# EAGLE design formBit (EAGLE 9.5.2)
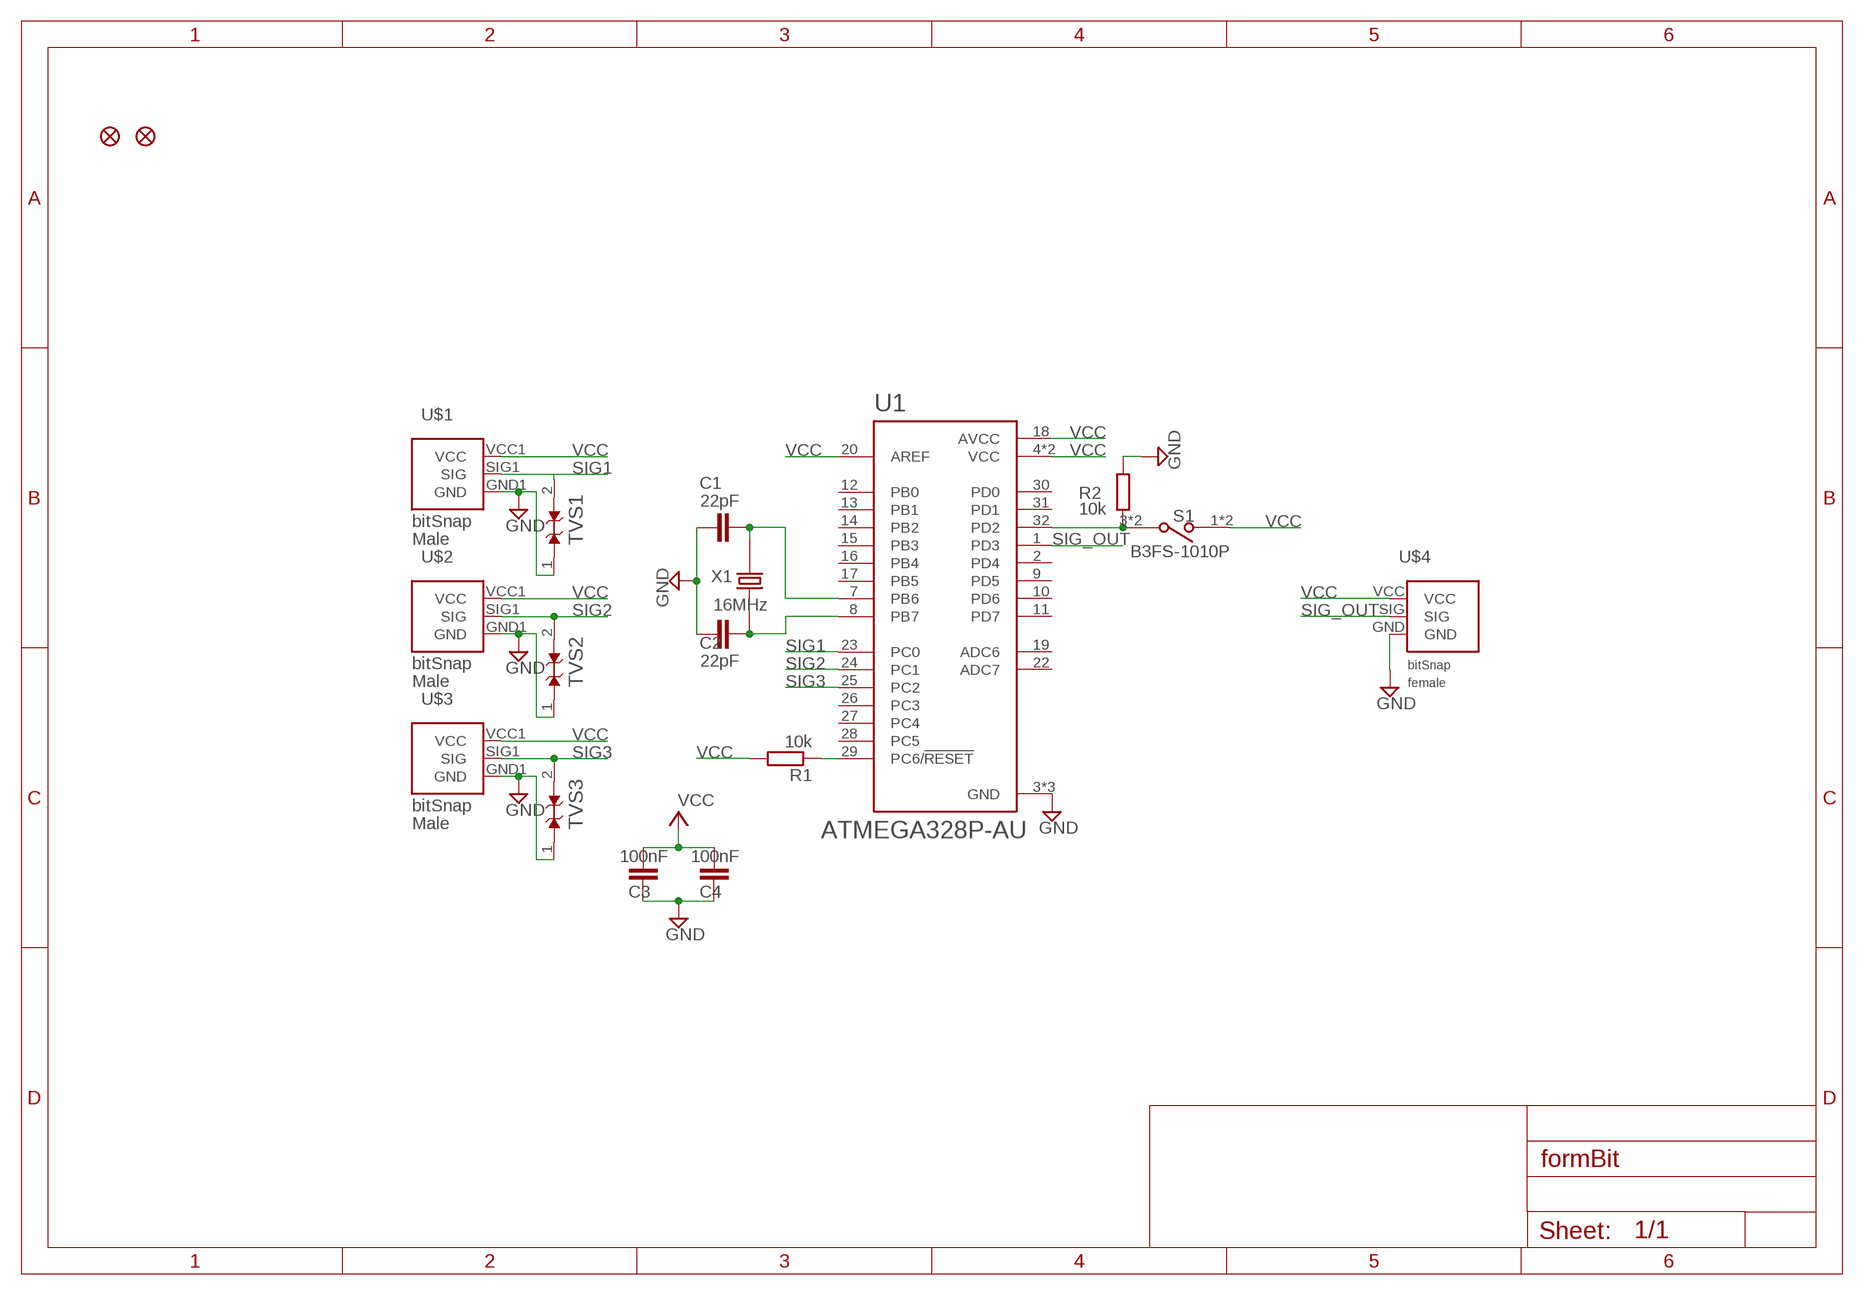
[diagram p0: schematic, sheet 1]

## Parts
C1  22pF  C-EUC0805  [C0805]
C2  22pF  C-EUC0805  [C0805]
C3  100nF  C-EUC0805  [C0805]
C4  100nF  C-EUC0805  [C0805]
R1  10k  R-EU_R0805  [R0805]
R2  10k  R-EU_R0805  [R0805]
S1  B3FS-1010P  [SW_B3FS-1010P]
TVS1  ESD9B5.0ST5G  [SODFL1006X40N]
TVS2  ESD9B5.0ST5G  [SODFL1006X40N]
TVS3  ESD9B5.0ST5G  [SODFL1006X40N]
U1  ATMEGA328P-AU  [QFP80P900X900X120-32N]
U$1  BITSNAP_V03_MALE  [BITSNAP_V03_MALE]
U$2  BITSNAP_V03_MALE  [BITSNAP_V03_MALE]
U$3  BITSNAP_V03_MALE  [BITSNAP_V03_MALE]
U$4  BITSNAP_V03_FEMALE  [BITSNAP_V03_FEMALE]
U$5  FIDUCIAL  [FIDUCIAL1X2.5]
U$6  FIDUCIAL  [FIDUCIAL1X2.5]
X1  16MHz  7A-24.000MAAJ-T  [XTAL500X320X120]

## Nets
GND: C1.1 C2.1 C3.1 C4.1 R2.1 TVS1.1(A) TVS2.1(A) TVS3.1(A) U1.3(GND) U1.5(GND) U1.21(GND) U$1.GND1(GND) U$2.GND1(GND) U$3.GND1(GND) U$4.GND
N$3: R2.2 S1.3 S1.4 U1.32(PD2)
N$5: C2.2 U1.8(PB7) X1.1
N$6: C1.2 U1.7(PB6) X1.2
N$7: R1.1 U1.29(PC6/!RESET)
SIG1: TVS1.2(A1) U1.23(PC0) U$1.SIG1(SIG)
SIG2: TVS2.2(A1) U1.24(PC1) U$2.SIG1(SIG)
SIG3: TVS3.2(A1) U1.25(PC2) U$3.SIG1(SIG)
SIG_OUT: U1.1(PD3) U$4.SIG
VCC: C3.2 C4.2 R1.2 S1.1 S1.2 U1.4(VCC) U1.6(VCC) U1.18(AVCC) U1.20(AREF) U$1.VCC1(VCC) U$2.VCC1(VCC) U$3.VCC1(VCC) U$4.VCC
Unconnected: U1.2(PD4) U1.9(PD5) U1.10(PD6) U1.11(PD7) U1.12(PB0) U1.13(PB1) U1.14(PB2) U1.15(PB3) U1.16(PB4) U1.17(PB5) U1.19(ADC6) U1.22(ADC7) U1.26(PC3) U1.27(PC4) U1.28(PC5) U1.30(PD0) U1.31(PD1)

## Library data of the parts
C1-C4 = rcl:C-EU: CAPACITOR, European symbol; SPICEPREFIX: C
R1 R2 = rcl:R-EU_: RESISTOR, European symbol; SPICEPREFIX: R
S1 = B3FS-1010P:B3FS-1010P: Switch Tactile N.O. SPST Flat Plunger Gull Wing 0.05A 24VDC 0.98N SMD Embossed T/R; AVAILABILITY: Unavailable; DESCRIPTION: Tactile Switch SPST-NO Top Actuated Surface Mount; MF: Omron Electronics; MP: B3FS1010P; PACKAGE: None; PRICE: None
TVS1-TVS3 = ESD9B5.0ST5G:ESD9B5.0ST5G: ESD9B Series 7.8 V 15 pF Surface Mount TVS Diode - SOD-923; AVAILABILITY: Unavailable; DESCRIPTION: Clamp Ipp Tvs Diode Surface Mount SOD-923; MF: ON Semiconductor; MP: ESD9B5.0ST5G; PACKAGE: SOD-923 ON Semiconductor; PRICE: None
U1 = ATMEGA328P-AU:ATMEGA328P-AU: ATmega Series 20 MHz 32 KB Flash 2 KB SRAM 8-Bit Microcontroller - TQFP-32; AVAILABILITY: Unavailable; DESCRIPTION: AVR AVR® ATmega Microcontroller IC 8-Bit 20MHz 32KB _16K x 16_ FLASH 32-TQFP _7x7_; MF: Microchip Technology; MP: ATMEGA328P-AU; PACKAGE: TQFP-32 Microchip Technology; PRICE: None
U$1-U$3 = bitSnap140813:BITSNAP_V03_MALE
U$4 = bitSnap140813:BITSNAP_V03_FEMALE
U$5 U$6 = LITTLEBITS140915:FIDUCIAL
X1 = 7A-24.000MAAJ-T:7A-24.000MAAJ-T: Crystal 24MHz 30ppm (Tol) 30ppm (Stability) 18pF FUND 50Ohm 2-Pin SMD T/R; AVAILABILITY: Unavailable; DESCRIPTION: 24MHz ±30ppm Crystal 18pF 50 Ohms 2-SMD, No Lead; MF: TXC; MP: 7A-24.000MAAJ-T; PACKAGE: SMD-2 TXC; PRICE: None

## Board
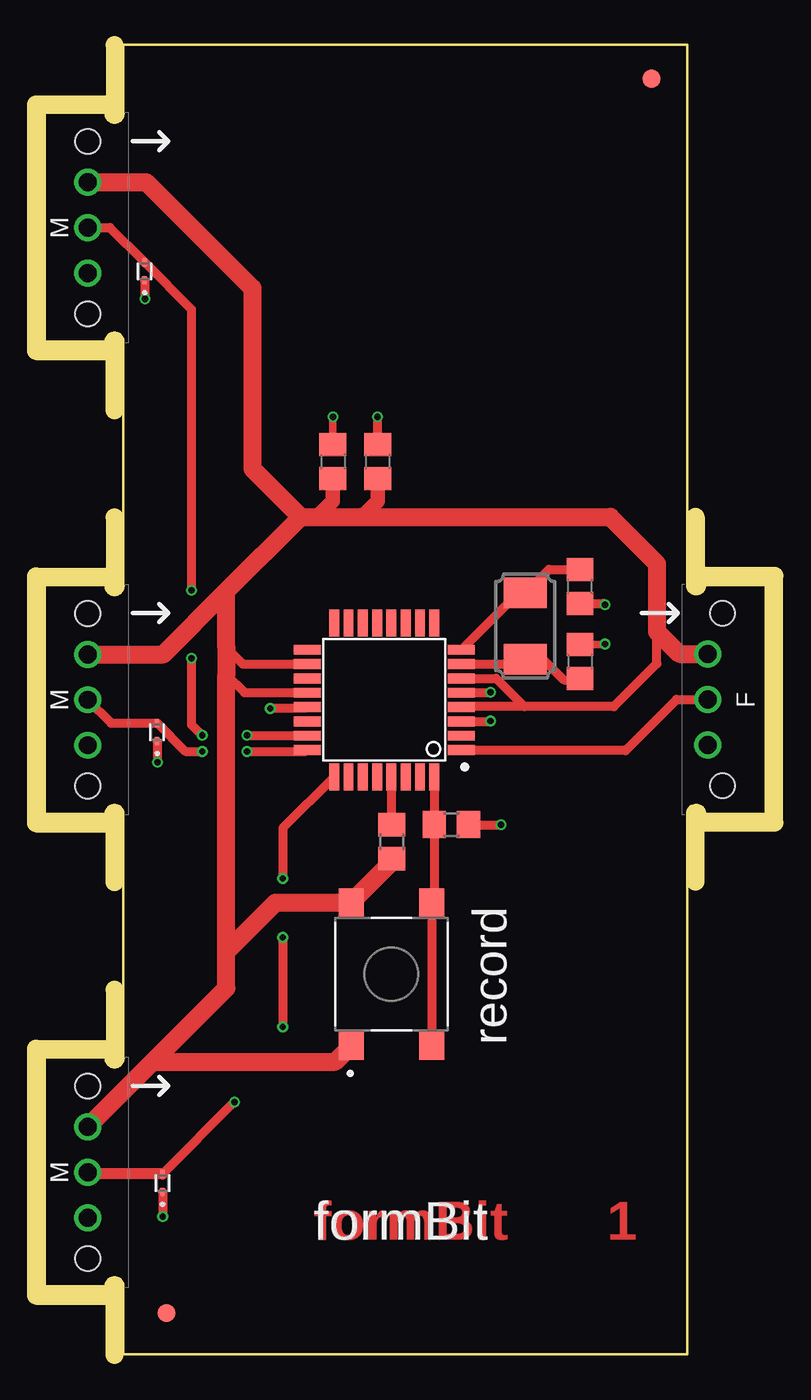
[diagram p1: board, top side]
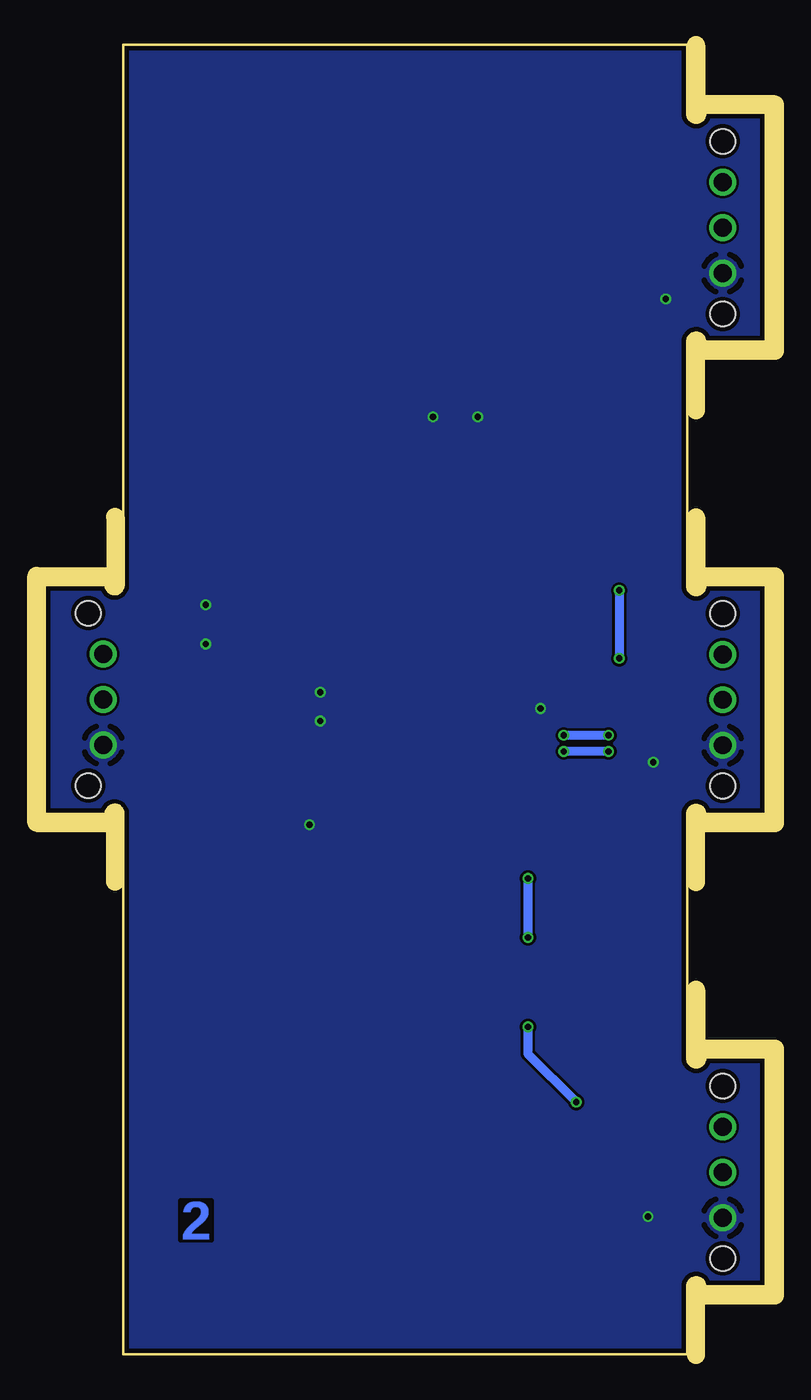
[diagram p2: board, bottom side, seen from below]

Size 40.3 x 73.22 mm. Coordinates in mm from the lower left corner, seen from the top.
Outline: 0,3.82 0,16.62 3.4,16.62 arc191 4.4,16.62 4.4,30.22 arc180 3.4,30.22 0,30.22 0,43.02 3.4,43.02 arc191 4.4,43.02 4.4,56.62 arc180 3.4,56.62 0,56.62 0,69.43 3.4,69.43 arc191 4.4,69.43 4.4,73.22 35.9,73.22 35.9,43.02 arc180 36.9,43.02 40.3,43.02 40.3,30.22 36.9,30.22 arc180 35.9,30.22 35.9,0.02 4.4,0.02 4.4,3.82 arc180 3.4,3.82 0,3.82
Copper layers (1*16): Top 0.018mm / dielectric 1.6mm / Bottom 0.018mm
Design rules "eC_2Layer_PClass6_BaseCopperO18_eCDefault *": minimum track width 0.15mm, minimum drill 0.35mm, track to track 0.15mm, track to pad 0.15mm, pad to pad 0.15mm, via to via 0.15mm, smd to smd 0mil, copper to edge 0.25mm, drill to drill 0.35mm, minimum pad ring 0.175mm, minimum via ring 0.125mm, stop-mask expansion 0mil, vias tented up to drill 0.45mm, thermal gap 0.2mm

### Footprints (pad centres in the part's own frame; a part is rotated, then mirrored left to right if it is on the bottom)
C0805 = smd 1.3 x 1.5: 1 -0.95,0; 2 0.95,0
R0805 = smd 1.3 x 1.5: 1 -0.95,0; 2 0.95,0
SW_B3FS-1010P = smd 1.6 x 1.4: 1 -4,2.25; 2 4,2.25; 3 -4,-2.25; 4 4,-2.25
SODFL1006X40N = smd 0.5 x 0.3: 1 -0.5,0; 2 0.5,0
QFP80P900X900X120-32N = smd 1.5 x 0.55: 1 -4.3,2.8; 2 -4.3,2; 3 -4.3,1.2; 4 -4.3,0.4; 5 -4.3,-0.4; 6 -4.3,-1.2; 7 -4.3,-2; 8 -4.3,-2.8; 17 4.3,-2.8; 18 4.3,-2; 19 4.3,-1.2; 20 4.3,-0.4; 21 4.3,0.4; 22 4.3,1.2; 23 4.3,2; 24 4.3,2.8 | smd 0.55 x 1.5: 9 -2.8,-4.3; 10 -2,-4.3; 11 -1.2,-4.3; 12 -0.4,-4.3; 13 0.4,-4.3; 14 1.2,-4.3; 15 2,-4.3; 16 2.8,-4.3; 25 2.8,4.3; 26 2,4.3; 27 1.2,4.3; 28 0.4,4.3; 29 -0.4,4.3; 30 -1.2,4.3; 31 -2,4.3; 32 -2.8,4.3
BITSNAP_V03_MALE = drill 1: GND1 9.145,2.61; SIG1 6.605,2.61; VCC1 4.065,2.61 | hole 1.4: 1.785,2.61; 11.425,2.61
BITSNAP_V03_FEMALE = drill 1: GND 4.065,3.44; SIG 6.605,3.44; VCC 9.145,3.44 | hole 1.4: 1.785,2.61; 11.425,2.61
FIDUCIAL1X2.5 = smd 1 x 1: 1 0,0
XTAL500X320X120 = smd 1.7 x 2.4: 1 -1.85,0; 2 1.85,0

### Placement (x,y rotation side)
C1  29.91,38.75 270 top
C2  29.91,42.95 90 top
C3  16.1,49.92 270 top
C4  18.6,49.92 270 top
R1  19.39,28.68 270 top
R2  22.72,29.63 180 top
S1  19.37,21.27 90 top
TVS1  5.58,60.56 90 top
TVS2  6.28,34.8 90 top
TVS3  6.58,9.6 90 top
U1  18.97,36.6 180 top
U$1  -0.2,69.6 270 top
U$2  -0.2,43.21 270 top
U$3  -0.2,16.8 270 top
U$4  40.48,30.02 90 top
U$5  6.8,2.32 0 top
U$6  33.9,71.32 0 top
X1  26.86,40.73 270 top

### Tracks (layer width: path | path; a pad name or v marks a point on that pad's centre or on a via)
GND  (via drill 0.35)
  Top 0.406: C1.1 31.3,39.7 v31.3,39.73 | C3.1 v16.1,52.42
  Top 0.508: R2.1 v25.5,29.62 | TVS3.1 6.58,7.74 v6.6,7.72 | TVS2.1 6.28,33.14 v6.3,33.12 | U1.21 14.59,36.12 v12.6,36.12 | U1.5 24.88,37 v24.9,37.02 | U1.3 24.88,35.41 v24.9,35.42 | TVS1.1 5.58,59.05 v5.6,59.02 | C1.1 30.18,39.7 | C2.1 31.23,41.99 v31.3,41.92 | C4.1 v18.6,52.42
  pour Bottom (no thermals): -1.6,75.62 41,75.62 41,-3.48 -1.6,-3.48
N$3
  Top 0.508: U1.32 R2.2 21.77,25.42 S1.4 S1.3
N$5
  Top 0.508: U1.8 26.45,42.59 X1.1 28.17,43.89 C2.2
N$6
  Top 0.508: U1.7 26.58,38.6 X1.2 27.84,38.88 29,37.73 29.83,37.73 C1.2
N$7
  Top 0.508: R1.1 19.39,32.28 U1.29
SIG1  (via drill 0.35)
  Top 0.508: U$1.SIG1 3.65,63 TVS1.2 8.2,58.45 v8.2,42.73 | v8.2,38.92 8.2,35.23 v8.8,34.62 | v11.3,34.62 14.65,34.62 U1.23
  Bottom 0.508: v8.2,42.73 v8.2,38.92 | v8.8,34.62 v11.3,34.62
SIG2  (via drill 0.35)
  Top 0.508: U$2.SIG1 3.71,35.3 TVS2.2 7.86,33.73 v8.8,33.73 | v11.3,33.73 14.59,33.73 U1.24
  Bottom 0.508: v8.8,33.73 v11.3,33.73
SIG3  (via drill 0.35)
  Top 0.508: U1.25 13.3,29.43 v13.3,26.62 | v13.3,23.32 v13.3,18.32 | v10.6,14.12 TVS3.2
  Top 0.61: U$3.SIG1 2.51,10.1 TVS3.2
  Bottom 0.508: v13.3,26.62 v13.3,23.32 | v13.3,18.32 13.3,16.82 v10.6,14.12
SIG_OUT
  Top 0.508: U$4.SIG 35.3,36.63 32.45,33.77 32.42,33.8 U1.1
VCC
  Top 0.508: 10.15,39.52 11.07,38.6 U1.18 | 10.15,38.02 11.17,37 U1.20 | 26.8,36.23 31.8,36.23 34.2,38.62 34.2,41.02 | U1.6 25.22,37.8 26.8,36.23 | 26.8,36.23 23.29,36.23 U1.4
  Top 0.813: 15.2,46.82 16.1,47.73 C3.2 | 17.7,46.82 18.6,47.73 C4.2
  Top 1.016: 10.15,42.67 6.62,39.15 U$2.VCC1 | 10.15,42.67 14.3,46.82 | 14.3,46.82 15.2,46.82 17.7,46.82 31.6,46.82 34.2,44.23 34.2,41.02 34.2,40.42 35.45,39.17 U$4.VCC | 14.3,46.82 11.6,49.52 11.6,59.62 5.68,65.54 U$1.VCC1 | 10.15,22.52 10.15,20.48 6.05,16.38 | 10.15,22.52 10.15,38.02 10.15,39.52 10.15,42.67 | 6.05,16.38 16.22,16.38 S1.1 | 10.15,22.52 12.9,25.27 S1.2 19.39,27.54 R1.2 | U$3.VCC1 6.05,16.38

### Text on the board
Top: formBit | 1
Bottom: 2
tNames: record | formBit